# Altium schematic sheet Car_2.0.SchDoc
size A4; DocumentNumber: 1; SheetNumber: 1; SheetTotal: 1
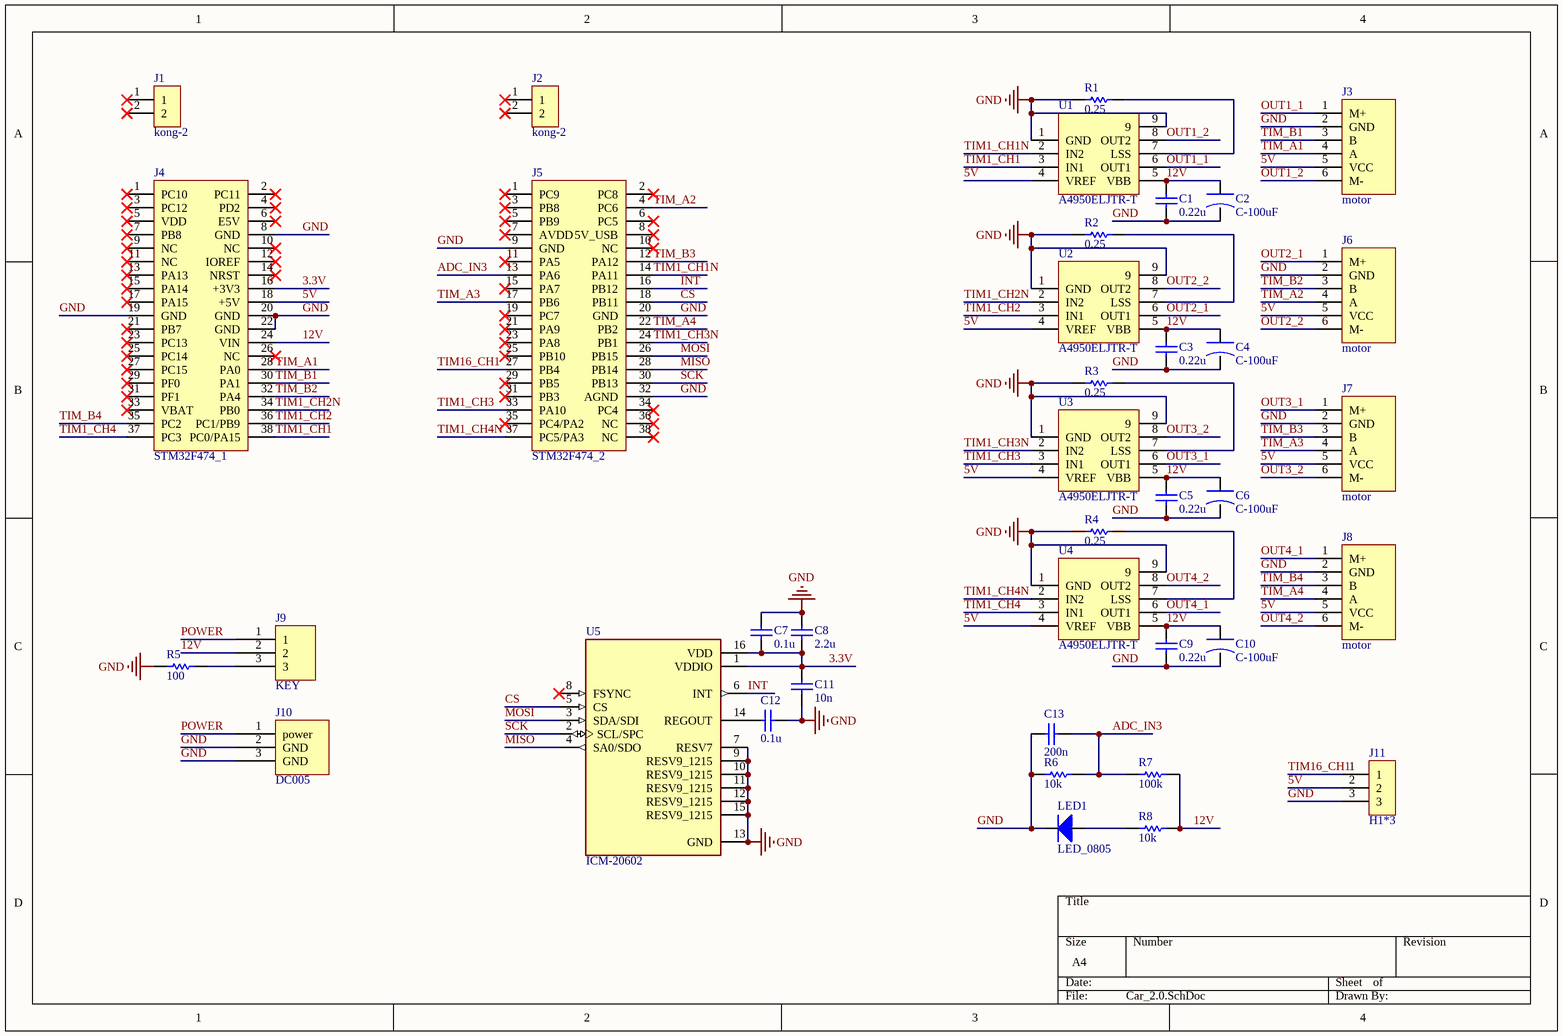
[diagram p0: Car_2.0.SchDoc]

## Parts
C1  0.22u  [C_0805]
C2  C-100uF  [SMD-EC-F6.3]
C3  0.22u  [C_0805]
C4  C-100uF  [SMD-EC-F6.3]
C5  0.22u  [C_0805]
C6  C-100uF  [SMD-EC-F6.3]
C7  0.1u  [C_0805]
C8  2.2u  [C_0805]
C9  0.22u  [C_0805]
C10  C-100uF  [SMD-EC-F6.3]
C11  10n  [C_0805]
C12  0.1u  [C_0805]
C13  200n  [C_0805]
J1  kong-2  [HDR1X2]
J2  kong-2  [HDR1X2]
J3  motor  [XH2.54-6P]
J4  STM32F474_1  [HDR2*19]
J5  STM32F474_2  [HDR2*19]
J6  motor  [XH2.54-6P]
J7  motor  [XH2.54-6P]
J8  motor  [XH2.54-6P]
J9  KEY  [SS-12D10]
J10  DC005  [DC-005]
J11  H1*3  [HDR1X3]
LED1  LED_0805  [LED0805]
R1  0.25  [R_2512]
R2  0.25  [R_2512]
R3  0.25  [R_2512]
R4  0.25  [R_2512]
R5  100  [R_0805]
R6  10k  [R_0805]
R7  100k  [R_0805]
R8  10k  [R_0805]
U1  A4950ELJTR-T  [SOIC-9N]
U2  A4950ELJTR-T  [SOIC-9N]
U3  A4950ELJTR-T  [SOIC-9N]
U4  A4950ELJTR-T  [SOIC-9N]
U5  ICM-20602  [PQFN-16N]

## Nets
GND: C1.1 C2.2 C3.1 C4.2 C5.1 C6.2 C7.1 C8.1 C9.1 C10.2 C11.1 C12.1 C13.1 J3.2(GND) J4.8(GND) J4.19(GND) J4.20(GND) J4.22(GND) J5.9(GND) J5.20(GND) J5.32(AGND) J6.2(GND) J7.2(GND) J8.2(GND) J10.2(GND) J10.3(GND) J11.3 LED1.2 R1.1 R2.1 R3.1 R4.1 R5.1 R6.1 U1.1(GND) U1.9 U2.1(GND) U2.9 U3.1(GND) U3.9 U4.1(GND) U4.9 U5.7(RESV7) U5.9(RESV9_1215) U5.10(RESV9_1215) U5.11(RESV9_1215) U5.12(RESV9_1215) U5.13(GND) U5.15(RESV9_1215)
3.3V: C7.2 C8.2 C11.2 J4.16(+3V3) U5.1(VDDIO) U5.16(VDD)
5V: J3.5(VCC) J4.18(+5V) J6.5(VCC) J7.5(VCC) J8.5(VCC) J11.2 U1.4(VREF) U2.4(VREF) U3.4(VREF) U4.4(VREF)
12V: C1.2 C2.1 C3.2 C4.1 C5.2 C6.1 C9.2 C10.1 J4.24(VIN) J9.2 R7.2 R8.2 U1.5(VBB) U2.5(VBB) U3.5(VBB) U4.5(VBB)
ADC_IN3: C13.2 J5.13(PA6) R6.2 R7.1
CS: J5.18(PB11) U5.5(CS)
INT: J5.16(PB12) U5.6(INT)
MISO: J5.28(PB14) U5.4(SA0/SDO)
MOSI: J5.26(PB15) U5.3(SDA/SDI)
OUT1_1: J3.1(M+) U1.6(OUT1)
OUT1_2: J3.6(M-) U1.8(OUT2)
OUT2_1: J6.1(M+) U2.6(OUT1)
OUT2_2: J6.6(M-) U2.8(OUT2)
OUT3_1: J7.1(M+) U3.6(OUT1)
OUT3_2: J7.6(M-) U3.8(OUT2)
OUT4_1: J8.1(M+) U4.6(OUT1)
OUT4_2: J8.6(M-) U4.8(OUT2)
POWER: J9.1 J10.1(power)
SCK: J5.30(PB13) U5.2(SCL/SPC)
TIM1_CH1: J4.38(PC0/PA15) U1.3(IN1)
TIM1_CH1N: J5.14(PA11) U1.2(IN2)
TIM1_CH2: J4.36(PC1/PB9) U2.3(IN1)
TIM1_CH2N: J4.34(PB0) U2.2(IN2)
TIM1_CH3: J5.33(PA10) U3.3(IN1)
TIM1_CH3N: J5.24(PB1) U3.2(IN2)
TIM1_CH4: J4.37(PC3) U4.3(IN1)
TIM1_CH4N: J5.37(PC5/PA3) U4.2(IN2)
TIM16_CH1: J5.27(PB4) J11.1
TIM_A1: J3.4(A) J4.28(PA0)
TIM_A2: J5.4(PC6) J6.4(A)
TIM_A3: J5.17(PB6) J7.4(A)
TIM_A4: J5.22(PB2) J8.4(A)
TIM_B1: J3.3(B) J4.30(PA1)
TIM_B2: J4.32(PA4) J6.3(B)
TIM_B3: J5.12(PA12) J7.3(B)
TIM_B4: J4.35(PC2) J8.3(B)
NetC12_2: C12.2 U5.14(REGOUT)
NetJ9_3: J9.3 R5.2
NetLED1_1: LED1.1 R8.1
NetR1_2: R1.2 U1.7(LSS)
NetR2_2: R2.2 U2.7(LSS)
NetR3_2: R3.2 U3.7(LSS)
NetR4_2: R4.2 U4.7(LSS)

Not connected (* = marked no-connect by the designer): J1 1* 2*; J2 1* 2*; J4 1(PC10)* 2(PC11)* 3(PC12)* 4(PD2)* 5(VDD)* 6(E5V)* 7(PB8)* 9(NC)* 10(NC)* 11(NC)* 12(IOREF)* 13(PA13)* 14(NRST)* 15(PA14)* 17(PA15)* 21(PB7)* 23(PC13)* 25(PC14)* 26(NC)* 27(PC15)* 29(PF0)* 31(PF1)* 33(VBAT)*; J5 1(PC9)* 2(PC8)* 3(PB8)* 5(PB9)* 6(PC5)* 7(AVDD)* 8(5V_USB)* 10(NC)* 11(PA5)* 15(PA7)* 19(PC7)* 21(PA9)* 23(PA8)* 25(PB10)* 29(PB5)* 31(PB3)* 34(PC4)* 35(PC4/PA2)* 36(NC)* 38(NC)*; U5 8(FSYNC)*

## Library data of the parts
C1 C3 C5 C7-C9 C11-C13 = C_0805
R1-R4 = R-2512
R5-R8 = R_0805
U1-U4 = A4950ELJTR-T: MF: RS Components; MP: A4950ELJTR-T; Package: SOIC-8 RS Components; Digi-Key_Purchase_URL: https://www.digikey.com/product-detail/en/allegro-microsystems/A4950ELJTR-T/620-1400-1-ND/2626340?utm_source=snapeda&utm_medium=aggregator&utm_campaign=symbol; Value: *; Digi-Key_Part_Number: 620-1400-1-ND; SnapEDA_Link: https://www.snapeda.com/parts/A4950ELJTR-T/RS%20Components/view-part/943919/?ref=snap
U5 = ICM-20602: Accelerometer, Gyroscope, Temperature, 6 Axis Sensor IÂ²C, SPI Output; MF: TDK InvenSense; Purchase-URL: https://pricing.snapeda.com/search/part/ICM-20602/?ref=eda; Package: PQFN-16 TDK-InvenSense; SnapEDA_Link: https://www.snapeda.com/parts/ICM-20602/TDK%20InvenSense/view-part/474472/?ref=snap; Value: *; Price: None; MP: ICM-20602; Check_prices: https://www.snapeda.com/parts/ICM-20602/TDK%20InvenSense/view-part/474472/?ref=eda; Availability: Good